# Altium schematic sheet PCIe-M2.SchDoc
size 297 x 209 mm
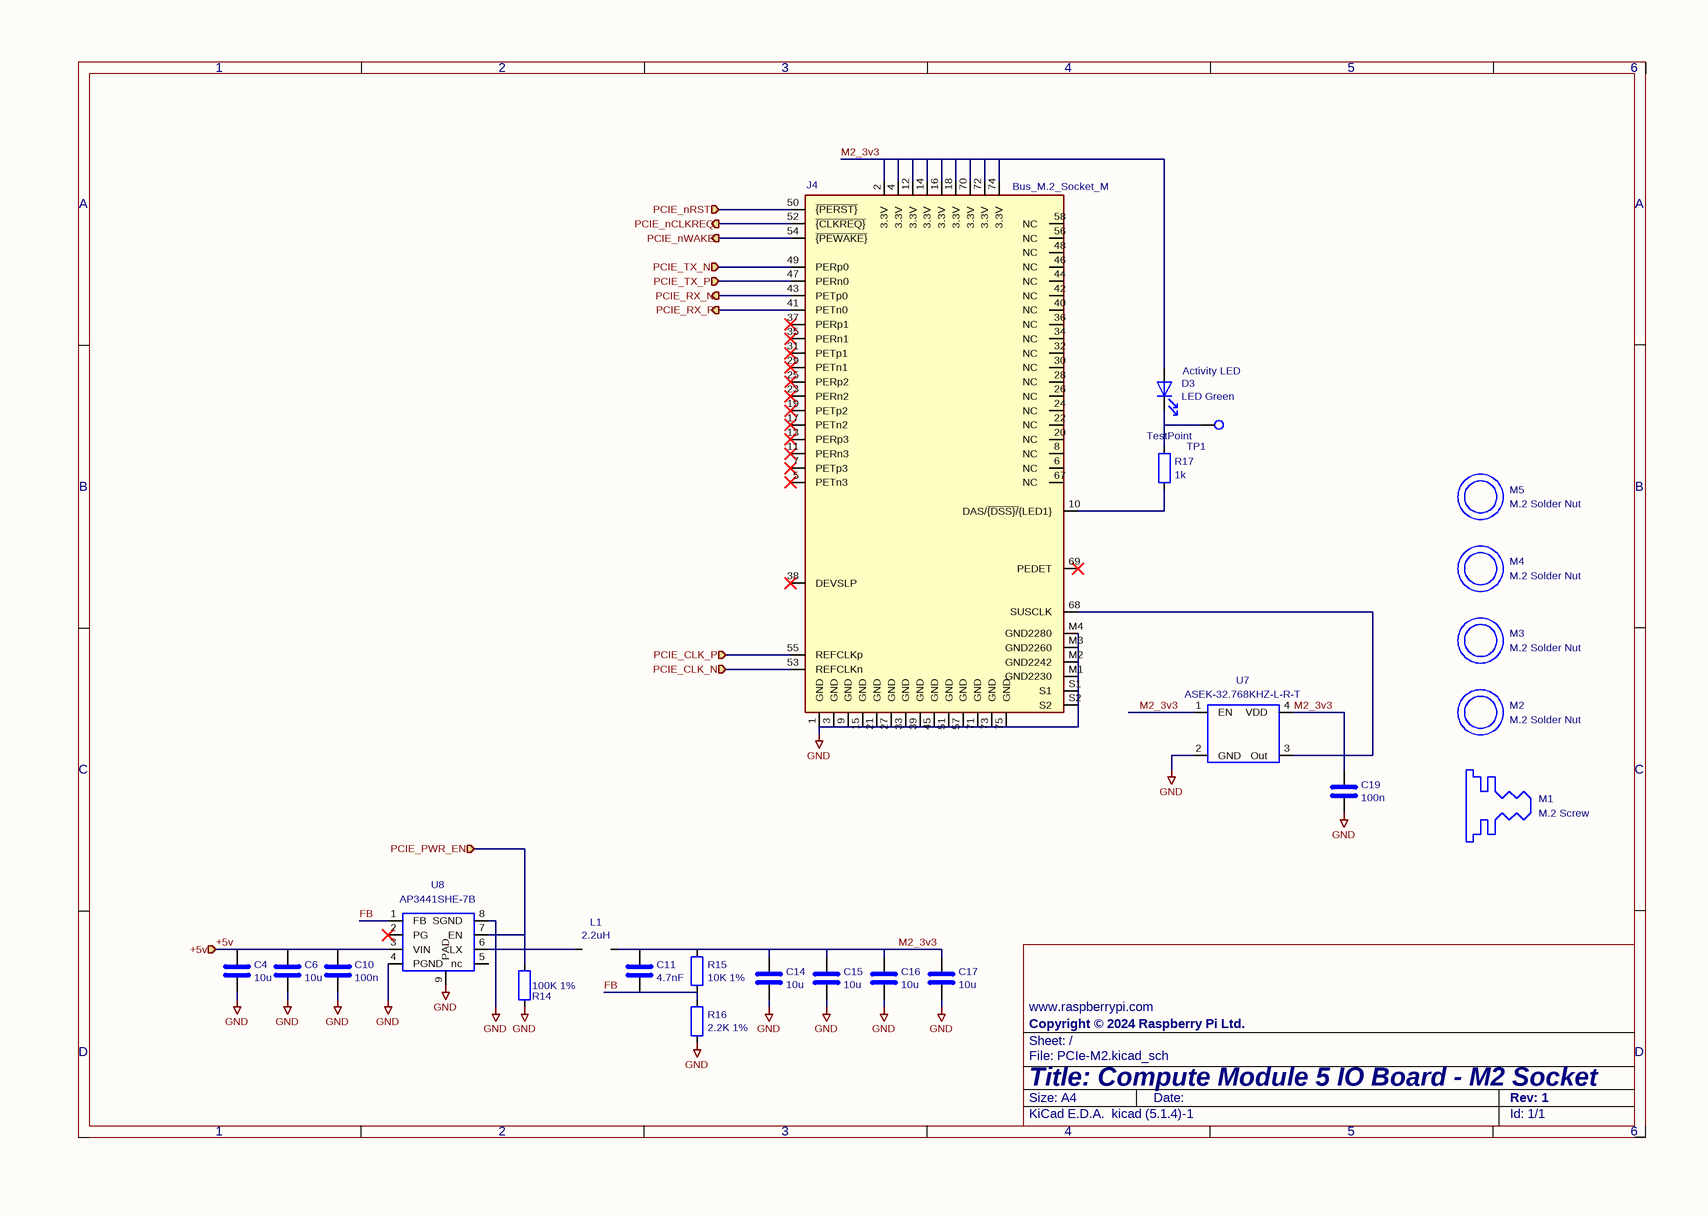
[diagram p0: PCIe-M2.SchDoc]

## Parts
C4  10u  [C_0805_2012Metric]
C6  10u  [C_0805_2012Metric]
C10  100n  [C_0402_1005Metric]
C11  4.7nF  [C_0402_1005Metric]
C14  10u  [C_0805_2012Metric]
C15  10u  [C_0805_2012Metric]
C16  10u  [C_0805_2012Metric]
C17  10u  [C_0805_2012Metric]
C19  100n  [C_0402_1005Metric]
D3  LED Green  [LED_0603_1608Metric]
J4  Bus_M.2_Socket_M  [M.2 M Key socket]
L1  2.2uH  [L_Bourns_SRP5030CC]
M1  M.2 Screw
M2  M.2 Solder Nut
M3  M.2 Solder Nut
M4  M.2 Solder Nut
M5  M.2 Solder Nut
R14  100K 1%  [R_0402_1005Metric]
R15  10K 1%  [R_0402_1005Metric]
R16  2.2K 1%  [R_0402_1005Metric]
R17  1k  [R_0402_1005Metric]
TP1  TestPoint  [TestPoint_Pad_2.0x2.0mm]
U7  ASEK-32.768KHZ-L-R-T  [Crystal_SMD_3225-4Pin_3.2x2.5mm]
U8  AP3441SHE-7B  [DFN-8-1EP_2x2mm_P0.5mm_EP1.05x1.75mm]

## Ports
+5v (in), PCIE_CLK_N (in), PCIE_CLK_P (in), PCIE_nCLKREQ (out), PCIE_nRST (in), PCIE_nWAKE (out), PCIE_PWR_EN (in), PCIE_RX_N (out), PCIE_RX_P (out), PCIE_TX_N (in), PCIE_TX_P (in)

## Nets
GND: C4.2 C6.2 C10.2 C14.2 C15.2 C16.2 C17.2 C19.2 J4.1(GND) J4.3(GND) J4.9(GND) J4.15(GND) J4.21(GND) J4.27(GND) J4.33(GND) J4.39(GND) J4.45(GND) J4.51(GND) J4.57(GND) J4.71(GND) J4.73(GND) J4.75(GND) J4.M1(GND2230) J4.M2(GND2242) J4.M3(GND2260) J4.M4(GND2280) J4.S1 J4.S2 R14.2 R16.2 U7.2(GND) U8.4(PGND) U8.8(SGND) U8.9(PAD)
+5v: C4.1 C6.1 C10.1 U8.3(VIN) ; port +5v
FB: C11.2 R15.2 R16.1 U8.1(FB)
M2_3v3: C11.1 C14.1 C15.1 C16.1 C17.1 C19.1 D3.2(A) J4.2(3.3V) J4.4(3.3V) J4.12(3.3V) J4.14(3.3V) J4.16(3.3V) J4.18(3.3V) J4.70(3.3V) J4.72(3.3V) J4.74(3.3V) L1.2 R15.1 U7.1(EN) U7.4(VDD)
PCIE_CLK_N: J4.53(REFCLKn) ; port PCIE_CLK_N
PCIE_CLK_P: J4.55(REFCLKp) ; port PCIE_CLK_P
PCIE_nCLKREQ: J4.52(~{{CLKREQ}}) ; port PCIE_nCLKREQ
PCIE_nRST: J4.50(~{{PERST}}) ; port PCIE_nRST
PCIE_nWAKE: J4.54(~{{PEWAKE}}) ; port PCIE_nWAKE
PCIE_PWR_EN: R14.1 U8.7(EN) ; port PCIE_PWR_EN
PCIE_RX_N: J4.43(PETp0) ; port PCIE_RX_N
PCIE_RX_P: J4.41(PETn0) ; port PCIE_RX_P
PCIE_TX_N: J4.49(PERp0) ; port PCIE_TX_N
PCIE_TX_P: J4.47(PERn0) ; port PCIE_TX_P
NetD3_1: D3.1(K) R17.1 TP1.1
NetJ4_10: J4.10(DAS/~{{DSS}/}{LED1}) R17.2
NetJ4_68: J4.68(SUSCLK) U7.3(Out)
NetL1_1: L1.1 U8.6(LX)

Not connected (* = marked no-connect by the designer): J4 5(PETn3)* 6(NC) 7(PETp3)* 8(NC) 11(PERn3)* 13(PERp3)* 17(PETn2)* 19(PETp2)* 20(NC) 22(NC) 23(PERn2)* 24(NC) 25(PERp2)* 26(NC) 28(NC) 29(PETn1)* 30(NC) 31(PETp1)* 32(NC) 34(NC) 35(PERn1)* 36(NC) 37(PERp1)* 38(DEVSLP)* 40(NC) 42(NC) 44(NC) 46(NC) 48(NC) 56(NC) 58(NC) 67(NC) 69(PEDET)*; U8 2(PG)* 5(nc)

## Notes on the sheet
- (near D3) Activity LED
- 1
- 2
- 3
- 4
- 5
- 6
- A
- B
- C
- www.raspberrypi.com <http://www.raspberrypi.com>
- D
- Title: Compute Module 5 IO Board - M2 Socket
- File: PCIe-M2.kicad_sch
- Sheet: /
- Copyright © 2024 Raspberry Pi Ltd.
- KiCad E.D.A.  kicad (5.1.4)-1
- Size: A4
- Date:
- Rev: 1
- Id: 1/1

## Library data of the parts
C4 C6 C14-C17 = C: Part Description: 10uF 10% 10V Ceramic Capacitor X7R 0805 (2012 Metric); Field4: Digikey; Field5: 490-14381-1-ND; Field6: GRM21BR71A106KA73L; Field7: Murata; Field8: 111893011; Value: 10u; Footprint: Capacitor_SMD:C_0805_2012Metric
C10 C19 = C: Part Description: 0.1uF 10% 16V Ceramic Capacitor X7R 0402 (1005 Metric); Field4: Farnell; Field5: 2611911; Field6: RM EMK105 B7104KV-F; Field7: TAIYO YUDEN EUROPE GMBH; Field8: 110091611; Value: 100n; Footprint: Capacitor_SMD:C_0402_1005Metric
C11 = C: Part Description: 4.7nF capacitor 0402; Value: 4.7nF; Footprint: Capacitor_SMD:C_0402_1005Metric
D3 = LED: Part Description: Green 572nm LED Indication - Discrete 2.2V 2-SMD, No Lead; Field4: Digikey; Field5: LTST-S270KGKT; Field6: SML-A12M8TT86N; Field7: Rohm; Field8: 650263301; Value: LED Green; Footprint: LED_SMD:LED_0603_1608Metric
J4 = Bus_M.2_Socket_M: Part Description: M.2 M Key connector; Description: M.2 Socket 3 Mechanical Key M; Field5: MTSSD03-67MSW337; Field7: MTCONN; Field6: MTSSD03-67MSW337; Value: Bus_M.2_Socket_M; Footprint: CM5IO:M.2 M Key socket
L1 = L: Part Description: Inductor, SMT, 2520, 2u2, IRMS=7A, ISAT=8A, DCR=0.032R; Field6: SRP5030CC-2R2M; Field7: Bourns; Field5: SRP5030CC-2R2M; Value: 2.2uH; Footprint: CM5IO:L_Bourns_SRP5030CC
M1 = M.2_Screw: Part Description: M.2 Screw; Value: M.2 Screw
M2-M5 = SolderNut: Part Description: Solder nut for M.2 slot; Value: M.2 Solder Nut
R14 = R: Part Description: Resistor 100K M1005 1% 63mW; Field4: Farnell; Field6: MCR01MZPF1003; Field7: Rohm; Value: 100K 1%; Footprint: Resistor_SMD:R_0402_1005Metric
R15 = R: Part Description: Resistor 10K M1005 1% 63mW; Field4: Farnell; Field7: Rohm; Field6: MCR01MZPF1002; Value: 10K 1%; Footprint: Resistor_SMD:R_0402_1005Metric
R16 = R: Part Description: Resistor 2.2K M1005 1% 63mW; Field4: Farnell; Value: 2.2K 1%; Footprint: Resistor_SMD:R_0402_1005Metric
R17 = R: Part Description: Resistor 1K M1005 1% 63mW; Field4: Farnell; Field5: 9239235; Field7: KOA EUROPE GMBH; Field6: RK73H1ETTP1001F; Field8: 125049511; Value: 1k; Footprint: Resistor_SMD:R_0402_1005Metric
TP1 = TestPoint: Field4: nf; Field5: nf; Field6: nf; Field7: nf; Part Description: Test point; Value: TestPoint; Footprint: TestPoint:TestPoint_Pad_2.0x2.0mm
U7 = ASEK-32.768KHZ-L-R-T: Part Description: 32KHz Xtal oscilator; Field7: abracon; Field5: ASEK-32.768KHZ-L-R-T; Field6: ASEK-32.768KHZ-L-R-T; Value: ASEK-32.768KHZ-L-R-T; Footprint: Crystal:Crystal_SMD_3225-4Pin_3.2x2.5mm
U8 = AP3441SHE-7B: Part Description: 3A DC-DC converter; Field7: Diodes; Field5: AP3441SHE-7B; Field6: AP3441SHE-7B; Value: AP3441SHE-7B; Footprint: Package_DFN_QFN:DFN-8-1EP_2x2mm_P0.5mm_EP1.05x1.75mm